# EAGLE design wifi_switch (EAGLE 7.7.0)
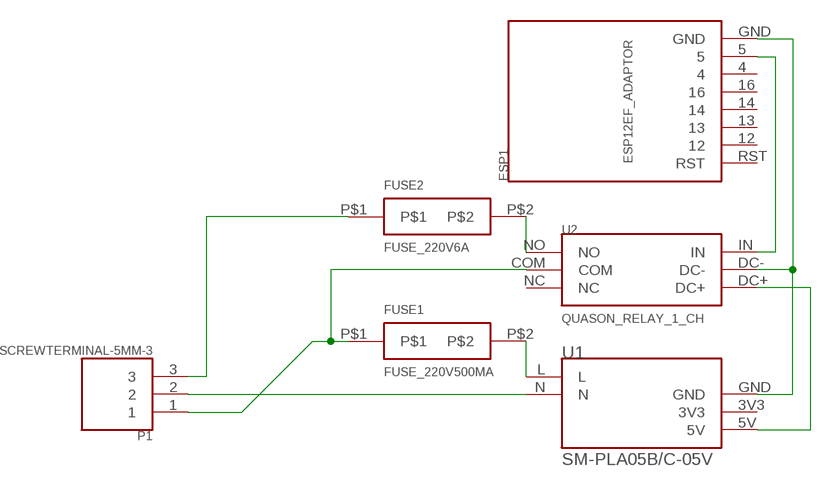
[diagram p0: schematic, sheet 1]

## Parts
ESP1  ESP12EF_ADAPTOR  [ESP12EF_ADAPTOR]
FUSE1  FUSE_220V500MA  [FUSE_220V_5X20MM]
FUSE2  FUSE_220V6A  [FUSE_220V_5X20MM]
P1  SCREWTERMINAL-5MM-3  [SCREWTERMINAL-5MM-3]
U1  SM-PLA05B/C-05V  [SM-PLA05B/C-05V]
U2  QUASON_RELAY_1_CH  [QUASON_RELAY_1_CH]

## Nets
N$1: P1.2 U1.N
N$2: FUSE1.P$2 U1.L
N$3: FUSE1.P$1 P1.1 U2.COM
N$4: FUSE2.P$1 P1.3
N$5: U1.5V U2.DC+
N$6: FUSE2.P$2 U2.NO
N$7: ESP1.GND U1.GND U2.DC-
N$8: ESP1.5 U2.IN
Unconnected: ESP1.4 ESP1.12 ESP1.13 ESP1.14 ESP1.16 ESP1.RST U1.3V3 U2.NC

## Library data of the parts
ESP1 = wifi_switch:ESP12EF_ADAPTOR: ESP-12E/F Adaptor designed by IFFPC.
FUSE1 = wifi_switch:FUSE_220V500MA: Fuse, 220V 500mA
FUSE2 = wifi_switch:FUSE_220V6A: Fuse, 220V 6A
P1 = wifi_switch:SCREWTERMINAL-5MM-3
U1 = wifi_switch:SM-PLA05B/C-05V: SANMIM_220V_5V3.5W_SM-PLA05B/C-05V AC/DC 220V to 5V Converter
U2 = wifi_switch:QUASON_RELAY_1_CH

## Board
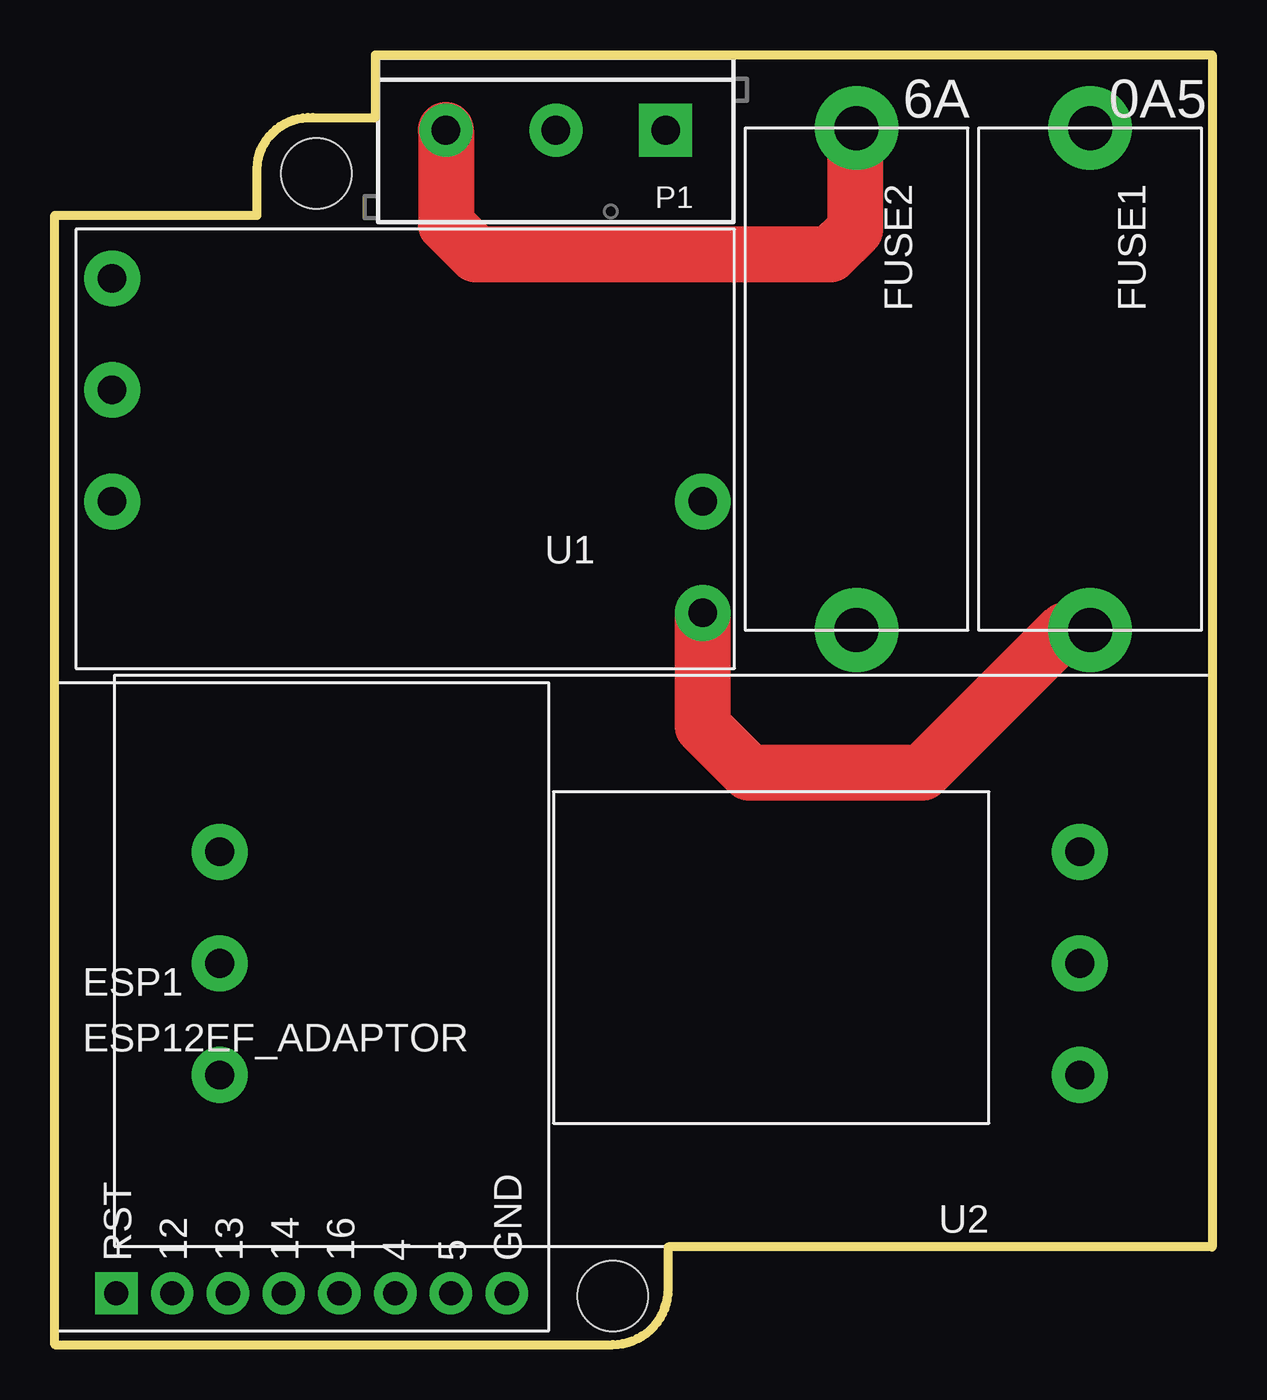
[diagram p1: board, top side]
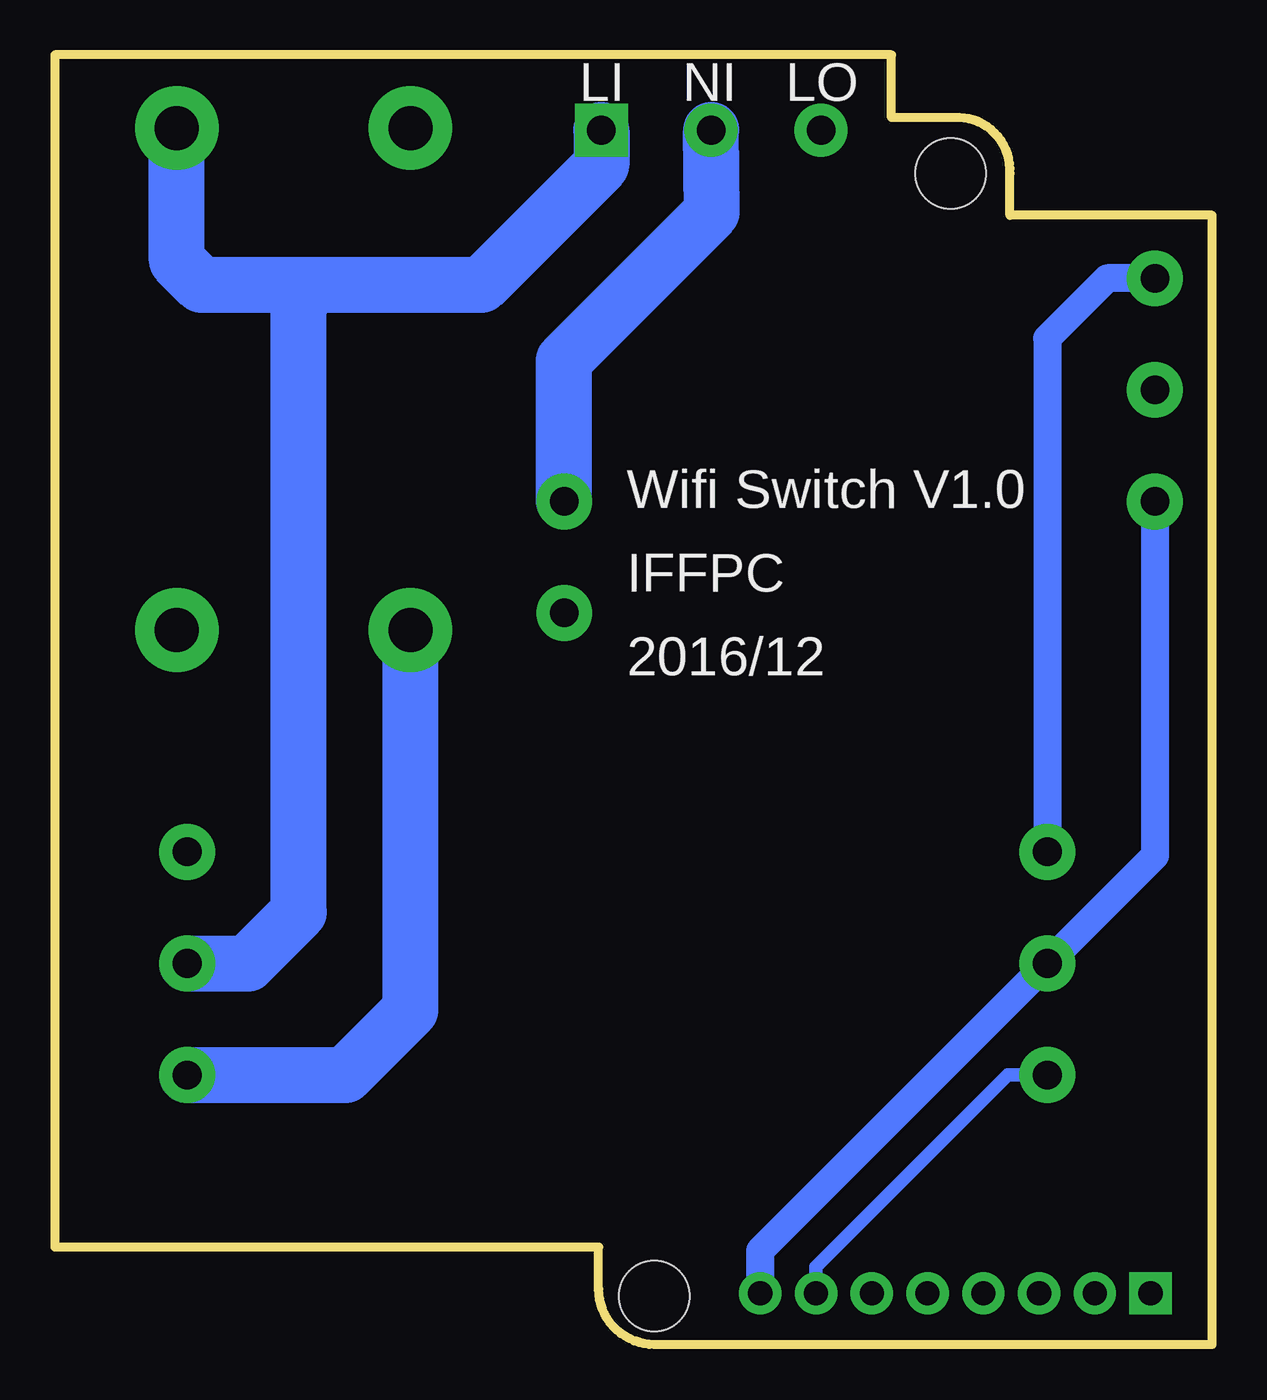
[diagram p2: board, bottom side, seen from below]

Size 52.7 x 58.74 mm. Coordinates in mm from the lower left corner, seen from the top.
Outline: 0,0 25.4,0 arc90 27.94,2.54 27.94,4.45 52.7,4.45 52.7,58.74 14.61,58.74 14.61,55.88 11.75,55.88 arc97 9.21,53.34 9.21,51.44 0,51.44 0,0
Copper layers (1*16): Top 0.035mm / dielectric 1.5mm / Bottom 0.035mm
Design rules "default": minimum track width 10mil, minimum drill 24mil, track to track 8mil, track to pad 8mil, pad to pad 8mil, via to via 8mil, smd to smd 8mil, copper to edge 40mil, drill to drill 8mil, minimum pad ring 10mil, minimum via ring 8mil, stop-mask expansion 4mil, vias tented up to drill 0mil, thermal gap 10mil
Holes 3.2 mm at 11.91,53.34 25.4,2.22

### Footprints (pad centres in the part's own frame; a part is rotated, then mirrored left to right if it is on the bottom)
ESP12EF_ADAPTOR = drill 1.1 pad 1.93: 4 15.5,1.7; 5 18.04,1.7; 12 5.34,1.7; 13 7.88,1.7; 14 10.42,1.7; 16 12.96,1.7; GND 20.58,1.7 | drill 1.1 pad 1.93 square: RST 2.8,1.7
FUSE_220V_5X20MM = drill 2 pad 3.81: P$1 0,5.08; P$2 22.86,5.08
SCREWTERMINAL-5MM-3 = drill 1.3 pad 2.413 square: 1 0,0 | drill 1.3 pad 2.413: 2 5,0; 3 10,0
SM-PLA05B/C-05V = drill 1.3 pad 2.54: 3V3 28.35,7.32; 5V 28.35,2.24; GND 28.35,12.4; L 1.45,17.48; N 1.45,12.4
QUASON_RELAY_1_CH = drill 1.3 pad 2.54: COM 6.024,13.12; DC+ 45.2,8.04; DC- 45.2,13.12; IN 45.2,18.2; NC 6.024,8.04; NO 6.024,18.2

### Placement (x,y rotation side)
ESP1  0,0.64 0 top
FUSE1  42.07,55.4 270 top
FUSE2  31.43,55.4 270 top
P1  27.81,55.31 180 top
U1  30.96,50.8 180 top
U2  52.7,30.48 180 top

### Tracks (layer width: path | path; a pad name or v marks a point on that pad's centre or on a via)
N$1
  Bottom 2.54: U1.N 29.53,38.42 29.53,44.83 22.78,51.58 P1.2
N$2
  Top 2.54: FUSE1.P$2 46.01,32.54 39.5,26.04 31.62,26.04 29.51,28.15 U1.L
N$3
  Bottom 0.254: 41.59,47.09 41.6,47.09 41.6,48.26
  Bottom 2.54: FUSE1.P$1 47.15,49.37 46.04,48.26 41.6,48.26 33.27,48.26 27.81,53.72 P1.1 | 41.59,47.62 41.59,47.09 41.59,19.68 43.92,17.36 U2.COM
N$4
  Top 2.54: P1.3 17.81,51.02 19.18,49.66 35.31,49.66 36.45,50.8 36.45,55.34 FUSE2.P$1
N$5
  Bottom 1.27: U1.5V 4.78,48.56 7.5,45.84 U2.DC+
N$6
  Bottom 2.54: FUSE2.P$2 36.51,15.24 39.47,12.28 U2.NO
N$7
  Bottom 1.27: ESP1.GND 20.58,4.29 U2.DC- 2.61,22.26 U1.GND
N$8
  Bottom 0.61: U2.IN 9.31,12.28 18.04,3.55 ESP1.5

### Text on the board
tPlace: 6A | 0A5
bPlace: LO | NI | LI | Wifi Switch V1.0 | IFFPC | 2016/12